# Altium schematic sheet Cellular.SchDoc
size B; SheetNumber: 6; SheetTotal: 9
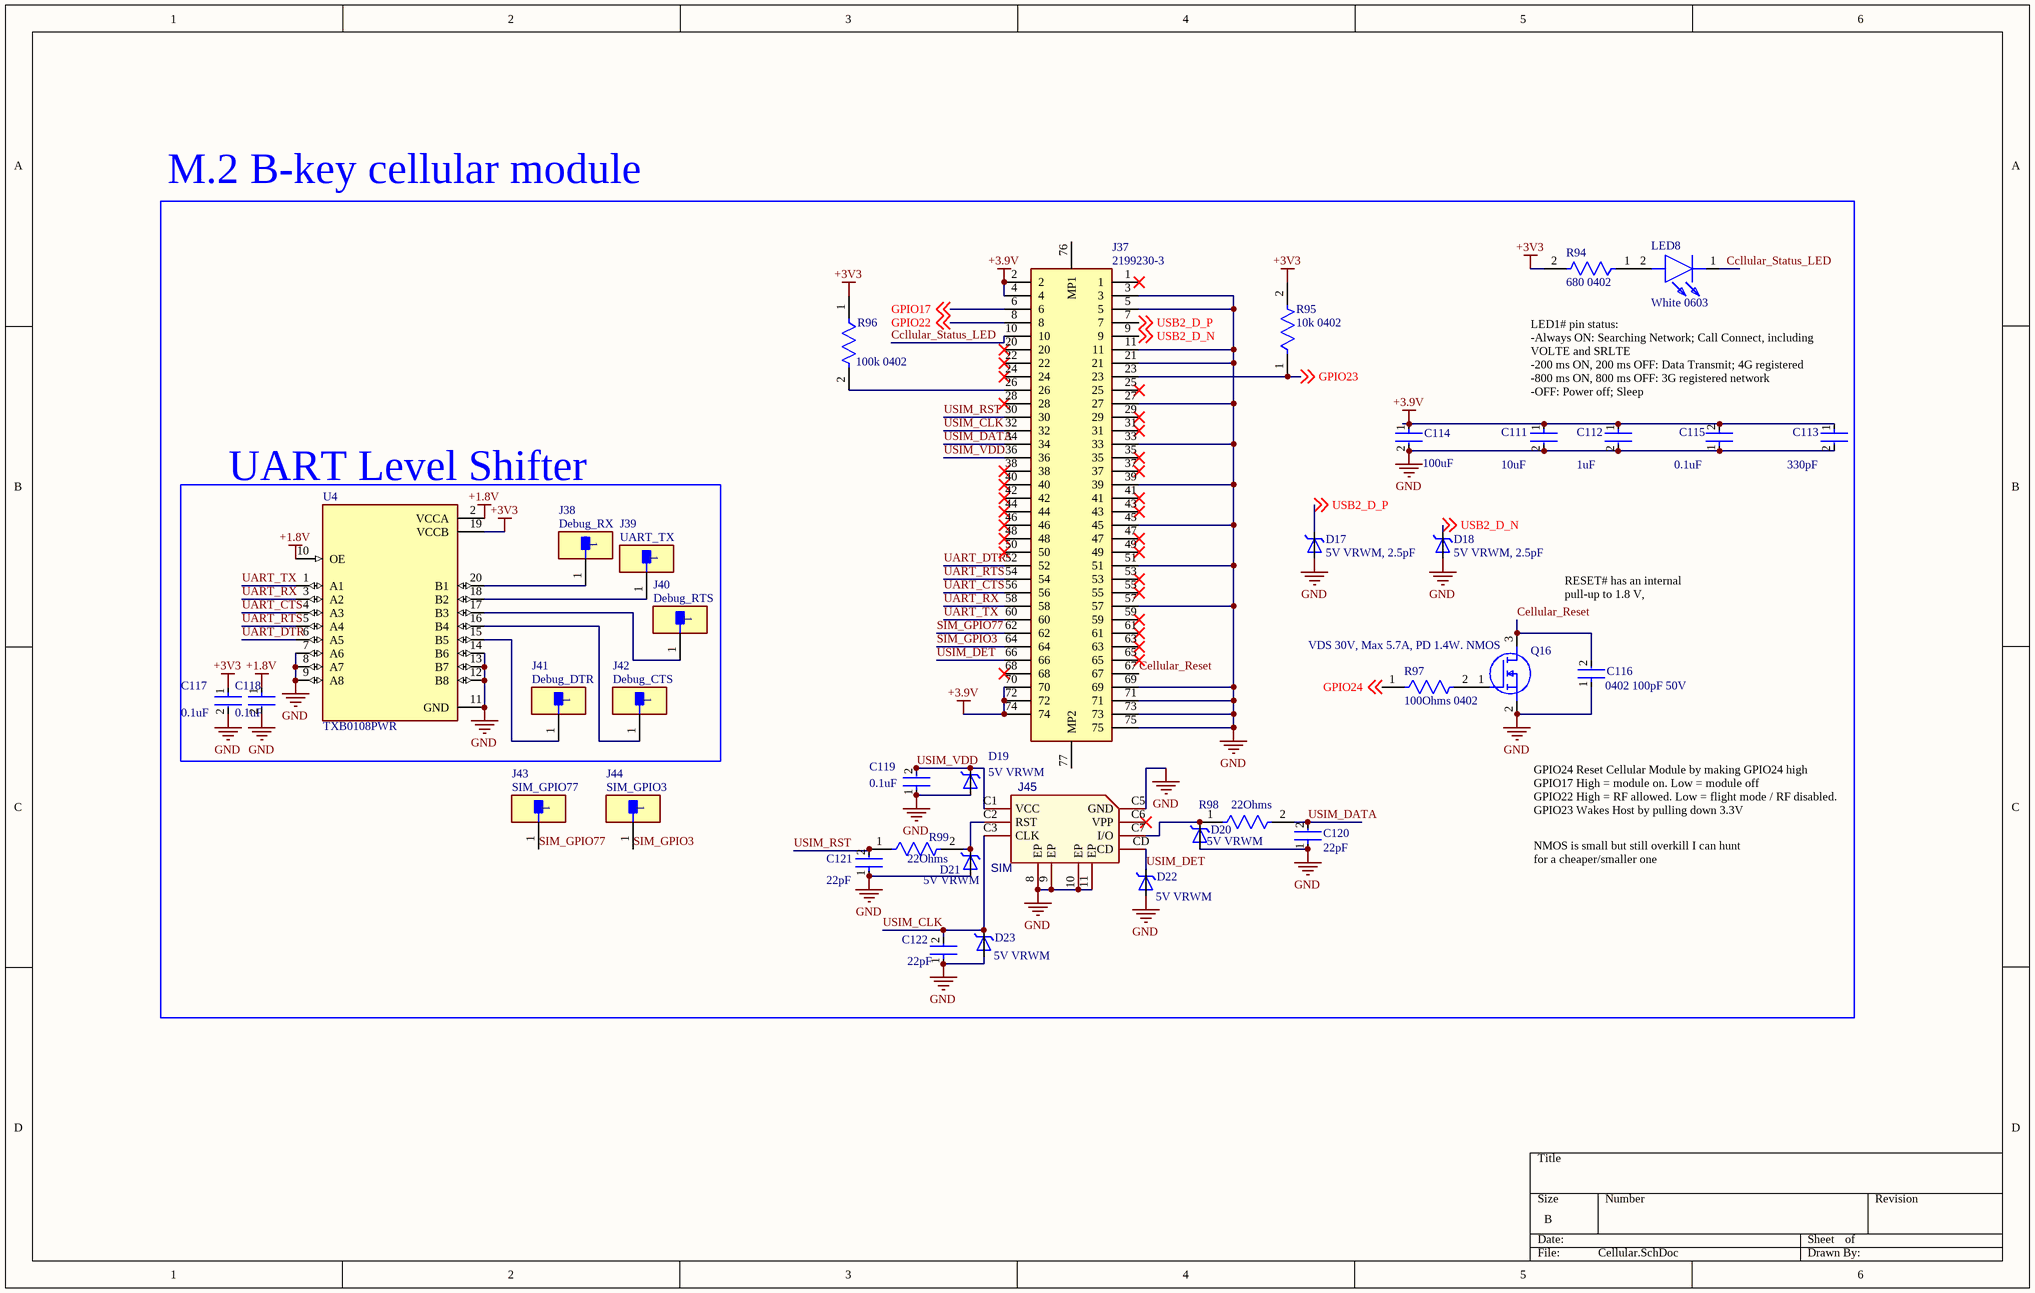
[diagram p0: Cellular.SchDoc]

## Parts
C111  10uF  [FP-CC0603-DC-MFG]
C112  1uF  [FP-C0402-BB-MFG]
C113  330pF  [FP-C0402-BB-MFG]
C114  100uF  [FP-CC1210-GD-IPC_A]
C115  0.1uF  [FP-C0402-BB-MFG]
C116  0402 100pF 50V  [FP-C0402-BB-MFG]
C117  0.1uF  [FP-C0402-BB-MFG]
C118  0.1uF  [FP-C0402-BB-MFG]
C119  0.1uF  [FP-C0402-BB-MFG]
C120  22pF  [FP-C0402-BB-MFG]
C121  22pF  [FP-C0402-BB-MFG]
C122  22pF  [FP-C0402-BB-MFG]
D17  5V VRWM, 2.5pF  [SODFL1060X40N]
D18  5V VRWM, 2.5pF  [SODFL1060X40N]
D19  5V VRWM  [SODFL1060X40N]
D20  5V VRWM  [SODFL1060X40N]
D21  5V VRWM  [SODFL1060X40N]
D22  5V VRWM  [SODFL1060X40N]
D23  5V VRWM  [SODFL1060X40N]
J37  2199230-3  [21992303]
J38  Debug_RX  [FP-5015-MFG]
J39  UART_TX  [FP-5015-MFG]
J40  Debug_RTS  [FP-5015-MFG]
J41  Debug_DTR  [FP-5015-MFG]
J42  Debug_CTS  [FP-5015-MFG]
J43  SIM_GPIO77  [FP-5015-MFG]
J44  SIM_GPIO3  [FP-5015-MFG]
J45  SIM  [PCBComponent_1]
LED8  White 0603  [LEDC1608X70N]
Q16  VDS 30V, Max 5.7A, PD 1.4W. NMOS  [SOT95P280X125-3N]
R94  680 0402  [FP-AF0402-IPC_B]
R95  10k 0402  [FP-RMCF0402-MFG]
R96  100k 0402  [FP-RMCF0402-MFG]
R97  100Ohms 0402  [FP-RMCF0402-MFG]
R98  22Ohms  [FP-RMCF0402-MFG]
R99  22Ohms  [FP-RMCF0402-MFG]
U4  TXB0108PWR  [SOP65P640X120-20N]

## Blocks framed on the sheet
M.2 B-key cellular module: C111-C116 C119-C122 D17-D23 J37 J43-J45 LED8 Q16 R94-R99
UART Level Shifter: C117 C118 J38-J42 U4

## Nets
+1.8V: C118.1 U4.2(VCCA) U4.10(OE)
+3.9V: C111.1 C112.1 C113.1 C114.1 C115.2 J37.2 J37.4 J37.70 J37.72 J37.74
+3V3: C117.1 R94.2 R95.2 R96.1 U4.19(VCCB)
GND: C111.2 C112.2 C113.2 C114.2 C115.1 C116.1 C117.2 C118.2 C119.1 C120.1 C121.1 C122.1 D17.2 D18.2 D19.2 D20.2 D21.2 D22.2 D23.2 J37.3 J37.5 J37.11 J37.21 J37.27 J37.33 J37.39 J37.45 J37.51 J37.57 J37.69 J37.71 J37.73 J37.75 J45.8(EP) J45.9(EP) J45.10(EP) J45.11(EP) J45.C5(GND) Q16.2(S) U4.7(A6) U4.8(A7) U4.9(A8) U4.11(GND) U4.12(B8) U4.13(B7) U4.14(B6)
Ccllular_Status_LED: J37.10 LED8.1(K)
Cellular_Reset: C116.2 J37.67 Q16.3(D)
GPIO17: J37.6 ; off-sheet GPIO17
GPIO22: J37.8 ; off-sheet GPIO22
GPIO23: J37.23 R95.1 ; off-sheet GPIO23
GPIO24: R97.1 ; off-sheet GPIO24
SIM_GPIO3: J37.64 J44.1
SIM_GPIO77: J37.62 J43.1
UART_CTS: J37.56 U4.4(A3)
UART_DTR: J37.52 U4.6(A5)
UART_RTS: J37.54 U4.5(A4)
UART_RX: J37.58 U4.3(A2)
UART_TX: J37.60 U4.1(A1)
USB2_D_N: D18.1 J37.9 ; off-sheet USB2_D_N
USB2_D_P: D17.1 J37.7 ; off-sheet USB2_D_P
USIM_CLK: C122.2 D23.1 J37.32 J45.C3(CLK)
USIM_DATA: C120.2 J37.34 R98.2
USIM_DET: D22.1 J37.66 J45.CD
USIM_RST: C121.2 J37.30 R99.1
USIM_VDD: C119.2 D19.1 J37.36 J45.C1(VCC)
NetD20_1: D20.1 J45.C7(I/O) R98.1
NetD21_1: D21.1 J45.C2(RST) R99.2
NetJ37_26: J37.26 R96.2
NetJ38_1: J38.1 U4.20(B1)
NetJ39_1: J39.1 U4.18(B2)
NetJ40_1: J40.1 U4.17(B3)
NetJ41_1: J41.1 U4.15(B5)
NetJ42_1: J42.1 U4.16(B4)
NetLED8_2: LED8.2(A) R94.1
NetQ16_1: Q16.1(G) R97.2

Not connected (* = marked no-connect by the designer): J37 1* 20* 22* 24* 25* 28* 29* 31* 35* 37* 38* 40* 41* 42* 43* 44* 46* 47* 48* 49* 50* 53* 55* 59* 61* 63* 65* 68* 76(MP1) 77(MP2); J45 C6(VPP)*

## Notes on the sheet
- LED1# pin status:
  -Always ON: Searching Network; Call Connect, including VOLTE and SRLTE
  -200 ms ON, 200 ms OFF: Data Transmit; 4G registered
  -800 ms ON, 800 ms OFF: 3G registered network
  -OFF: Power off; Sleep
- RESET# has an internal pull-up to 1.8 V,
- GPIO24 Reset Cellular Module by making GPIO24 high
  GPIO17 High = module on. Low = module off
  GPIO22 High = RF allowed. Low = flight mode / RF disabled.
  GPIO23 Wakes Host by pulling down 3.3V
  Current Needed:
- NMOS is small but still overkill I can hunt for a cheaper/smaller one

## Library data of the parts
C111 = CMP-00621-81932632-1: C96446; Capacitance: 10µF; Voltage Rating: 16V; Dielectric: X5R; Material: Ceramic; Tolerance: 10%; NexarPartId: 81932632; Height: 1mm; Halogen Free: Halogen Free; Max Operating Temperature: 85°C; Voltage Rating (DC): 16V; Lead Free: Lead Free; RoHS: Non-Compliant; Min Operating Temperature: -55°C; Case/Package: 0603
C112 = CMP-03020-014070-2: C52923; Manufacturer: Kemet; Manufacturer Part Number: C0402C104M3PAC7867; Material: Ceramic; Tolerance: 0.2; Temperature Characteristic: X5R; Value: 0.10 μF; Temperature Coefficient: 15%; Voltage Rating: 25 V; Height: 0.55mm; Category: Cap; Temperature: -55°C to +125°C; Automotive: No; Package: C0402-BB; Temperature Range Low: -55°C; ComponentLink2Description: Datasheet; Device Class L3: Ceramic Capacitors; ComponentLink2URL: https://content.kemet.com/datasheets/KEM_C1002_X7R_SMD.pdf; Octopart: https://octopart.com/c0402c104m3pac7867-kemet-84304880; RoHS: TRUE; Temperature Range High: +125°C; Device Class L1: Passive Components; Capacitance: 0.10 μF; Lead Free: Yes; Ipc Land Pattern Name: CAPC10050X50; Device Class L2: Capacitors; Digikey Description: CAP CER 0.1UF 25V X5R 0402
C113 = CMP-03020-014070-2: C13533; Manufacturer: Kemet; Manufacturer Part Number: C0402C104M3PAC7867; Material: Ceramic; Tolerance: 0.2; Temperature Characteristic: X5R; Value: 0.10 μF; Temperature Coefficient: 15%; Voltage Rating: 25 V; Height: 0.55mm; Category: Cap; Temperature: -55°C to +125°C; Automotive: No; Package: C0402-BB; Temperature Range Low: -55°C; ComponentLink2Description: Datasheet; Device Class L3: Ceramic Capacitors; ComponentLink2URL: https://content.kemet.com/datasheets/KEM_C1002_X7R_SMD.pdf; Octopart: https://octopart.com/c0402c104m3pac7867-kemet-84304880; RoHS: TRUE; Temperature Range High: +125°C; Device Class L1: Passive Components; Capacitance: 0.10 μF; Lead Free: Yes; Ipc Land Pattern Name: CAPC10050X50; Device Class L2: Capacitors; Digikey Description: CAP CER 0.1UF 25V X5R 0402
C114 = CMP-03422-001480-1: C7432790; Capacitance: 220uF; Tolerance: 20%; Voltage Rating: 6.3V; Max Operating Temperature: 85°C; Mount: Surface Mount; RoHS Compliant: Yes; Packaging: Tape and Reel; Case/Package: 1210; Min Operating Temperature: -55°C
C115 C117-C119 = CMP-03020-014070-2: C307331; Manufacturer: Kemet; Manufacturer Part Number: C0402C104M3PAC7867; Material: Ceramic; Tolerance: 0.2; Temperature Characteristic: X5R; Value: 0.10 μF; Temperature Coefficient: 15%; Voltage Rating: 25 V; Height: 0.55mm; Category: Cap; Temperature: -55°C to +125°C; Automotive: No; Package: C0402-BB; Temperature Range Low: -55°C; ComponentLink2Description: Datasheet; Device Class L3: Ceramic Capacitors; ComponentLink2URL: https://content.kemet.com/datasheets/KEM_C1002_X7R_SMD.pdf; Octopart: https://octopart.com/c0402c104m3pac7867-kemet-84304880; RoHS: TRUE; Temperature Range High: +125°C; Device Class L1: Passive Components; Capacitance: 0.10 μF; Lead Free: Yes; Ipc Land Pattern Name: CAPC10050X50; Device Class L2: Capacitors; Digikey Description: CAP CER 0.1UF 25V X5R 0402
C116 = CMP-03020-014070-2: C1546; Manufacturer: Kemet; Manufacturer Part Number: C0402C104M3PAC7867; Material: Ceramic; Tolerance: 0.2; Temperature Characteristic: X5R; Value: 0.10 μF; Temperature Coefficient: 15%; Voltage Rating: 25 V; Height: 0.55mm; Category: Cap; Temperature: -55°C to +125°C; Automotive: No; Package: C0402-BB; Temperature Range Low: -55°C; ComponentLink2Description: Datasheet; Device Class L3: Ceramic Capacitors; ComponentLink2URL: https://content.kemet.com/datasheets/KEM_C1002_X7R_SMD.pdf; Octopart: https://octopart.com/c0402c104m3pac7867-kemet-84304880; RoHS: TRUE; Temperature Range High: +125°C; Device Class L1: Passive Components; Capacitance: 0.10 μF; Lead Free: Yes; Ipc Land Pattern Name: CAPC10050X50; Device Class L2: Capacitors; Digikey Description: CAP CER 0.1UF 25V X5R 0402
C120-C122 = CMP-03020-014070-2: C1555; Manufacturer: Kemet; Manufacturer Part Number: C0402C104M3PAC7867; Material: Ceramic; Tolerance: 0.2; Temperature Characteristic: X5R; Value: 0.10 μF; Temperature Coefficient: 15%; Voltage Rating: 25 V; Height: 0.55mm; Category: Cap; Temperature: -55°C to +125°C; Automotive: No; Package: C0402-BB; Temperature Range Low: -55°C; ComponentLink2Description: Datasheet; Device Class L3: Ceramic Capacitors; ComponentLink2URL: https://content.kemet.com/datasheets/KEM_C1002_X7R_SMD.pdf; Octopart: https://octopart.com/c0402c104m3pac7867-kemet-84304880; RoHS: TRUE; Temperature Range High: +125°C; Device Class L1: Passive Components; Capacitance: 0.10 μF; Lead Free: Yes; Ipc Land Pattern Name: CAPC10050X50; Device Class L2: Capacitors; Digikey Description: CAP CER 0.1UF 25V X5R 0402
D17-D23 = ESD9M5.0ST5G: C242267; MF: ON Semiconductor; Mouser-Purchase-URL: https://snapeda.com/shop?store=Mouser&id=218558; Price: None; Package: SOD-923 ON Semiconductor; Value: *; MP: ESD9M5.0ST5G; SnapEDA_Link: https://www.snapeda.com/parts/ESD9M5.0ST5G/ON%20Semiconductor/view-part/218558/?ref=snap; Availability: Warning; BuyPart: https://www.snapeda.com/parts/ESD9M5.0ST5G/ON%20Semiconductor/view-part/218558/?ref=eda
J37 = 2199230-3: C590859; Manufacturer_Name: TE Connectivity; Datasheet Link: https://componentsearchengine.com/Datasheets/2/2199230-3.pdf; Manufacturer_Part_Number: 2199230-3; Mouser Part Number: 571-2199230-3; Mouser Price/Stock: https://www.mouser.co.uk/ProductDetail/TE-Connectivity/2199230-3?qs=EQCnRgr4b6HElQOKr5ma1Q%3D%3D; Arrow Part Number: 2199230-3; Arrow Price/Stock: https://www.arrow.com/en/products/2199230-3/te-connectivity?utm_currency=USD&region=nac
J38-J44 = CMP-2000-05183-2: PC TEST POINT MINIATURE; Manufacturer Part Number: 5015; Manufacturer: keystone; Number Of Contacts: 1; Conn Orientation: Straight; Category: Conn; Digikey Description: PC TEST POINT MINIATURE; Automotive: No; Lead Free: Yes; Octopart: https://octopart.com/5015-keystone-3822; ComponentLink2URL: http://www.keyelco.com/product-pdf.cfm?p=1353; Package: 5015; RoHS: TRUE; Device Class L3: unset; Device Class L2: unset; Contact Material: Silver; Device Class L1: Connectors; Height: 1.65mm; ComponentLink2Description: Datasheet
J45 = SMN-303: C266888; Manufacturer: XUNPU(讯普); Add into BOM: yes; Card Connection Mode: Push-Push; Card Type: Nano-SIM Card; Connector Type: Connector and Ejector; Card Detection: With Card Detect; Symbol: SMN-303; Device: SMN-303; LCSC Part Name: 自弹式 NanoSIM卡 卡座; Supplier Part: C266888; Manufacturer Part: SMN-303; Supplier Footprint: SMD; JLCPCB Part Class: Extended Part; Datasheet: https://item.szlcsc.com/datasheet/SMN-303/256999.html; Supplier: LCSC; Convert to PCB: yes; Supplementary Features: -; Height Above Board: 1.37mm; Rated Voltage (Max): -; Operating Temperature: -25℃~+85℃
LED8 = KT-0603R: C2290; Manufacturer_Name: Hubei KENTO Elec; Datasheet Link: https://datasheet.lcsc.com/szlcsc/Hubei-KENTO-Elec-KT-0603R_C2286.pdf; Height: 0.7mm; Manufacturer_Part_Number: KT-0603R; LCSC: C2286
Q16 = AO3400A: C20917; Manufacturer_Name: Alpha & Omega Semiconductors; Datasheet Link: http://aosmd.com/res/data_sheets/AO3400A.pdf; Height: 1.25mm; Manufacturer_Part_Number: AO3400A; Arrow Part Number: AO3400A; Arrow Price/Stock: https://www.arrow.com/en/products/ao3400a/alpha-and-omega-semiconductor?utm_currency=USD&region=nac
R94 = CMP-03412-049911-1: C2835749; Resistance: 4.3kR; Max Power Dissipation: 63mW; Temperature Coefficient: 100ppm/°C; Tolerance: 5%; Case/Package: 0402; Height: 0.015inch; Width: 0.02inch; Min Operating Temperature: -55°C; Packaging: Tape and Reel; Max Operating Temperature: 155°C; Features: Moisture Resistant; Series: AF; Number of Terminations: 2; Length: 0.039inch; Resistor Type: Thick Film; RoHS Compliant: Yes
R95 = CMP-26527-002093-1: C25744; Max Power Dissipation: 63mW; Tolerance: 5%; Resistance: 3.9R; Temperature Coefficient: 200ppm/°C; Case/Package: 0402; Number of Terminations: 2; Min Operating Temperature: -55°C; Height: 0.016inch; Packaging: Tape and Reel; Resistor Type: Thick Film; Length: 0.039inch; Mount: Surface Mount; Series: RMCF; Max Operating Temperature: 155°C; Contact Plating: Tin; Features: Automotive AEC-Q200; Width: 0.02inch; Radiation Hardening: No; RoHS Compliant: Yes
R96 = CMP-26527-002093-1: C25741; Max Power Dissipation: 63mW; Tolerance: 5%; Resistance: 3.9R; Temperature Coefficient: 200ppm/°C; Case/Package: 0402; Number of Terminations: 2; Min Operating Temperature: -55°C; Height: 0.016inch; Packaging: Tape and Reel; Resistor Type: Thick Film; Length: 0.039inch; Mount: Surface Mount; Series: RMCF; Max Operating Temperature: 155°C; Contact Plating: Tin; Features: Automotive AEC-Q200; Width: 0.02inch; Radiation Hardening: No; RoHS Compliant: Yes
R97 = CMP-26527-002093-1: C25076; Max Power Dissipation: 63mW; Tolerance: 5%; Resistance: 3.9R; Temperature Coefficient: 200ppm/°C; Case/Package: 0402; Number of Terminations: 2; Min Operating Temperature: -55°C; Height: 0.016inch; Packaging: Tape and Reel; Resistor Type: Thick Film; Length: 0.039inch; Mount: Surface Mount; Series: RMCF; Max Operating Temperature: 155°C; Contact Plating: Tin; Features: Automotive AEC-Q200; Width: 0.02inch; Radiation Hardening: No; RoHS Compliant: Yes
R98 R99 = CMP-26527-002093-1: C25092; Max Power Dissipation: 63mW; Tolerance: 5%; Resistance: 3.9R; Temperature Coefficient: 200ppm/°C; Case/Package: 0402; Number of Terminations: 2; Min Operating Temperature: -55°C; Height: 0.016inch; Packaging: Tape and Reel; Resistor Type: Thick Film; Length: 0.039inch; Mount: Surface Mount; Series: RMCF; Max Operating Temperature: 155°C; Contact Plating: Tin; Features: Automotive AEC-Q200; Width: 0.02inch; Radiation Hardening: No; RoHS Compliant: Yes
U4 = TXB0108PWR: C53406; MF: Texas Instruments; SnapEDA_Link: https://www.snapeda.com/parts/TXB0108PWR/Texas+Instruments/view-part/?ref=snap; Package: TSSOP-20 Texas Instruments; MP: TXB0108PWR; Check_prices: https://www.snapeda.com/parts/TXB0108PWR/Texas+Instruments/view-part/?ref=eda; Purchase-URL: https://pricing.snapeda.com/search/part/TXB0108PWR/?ref=eda; Digi-Key_Part_Number: 296-21527-2-ND; Value: *